# Altium schematic sheet MNA6A.SchDoc
size A4; SheetNumber: 1; SheetTotal: 4
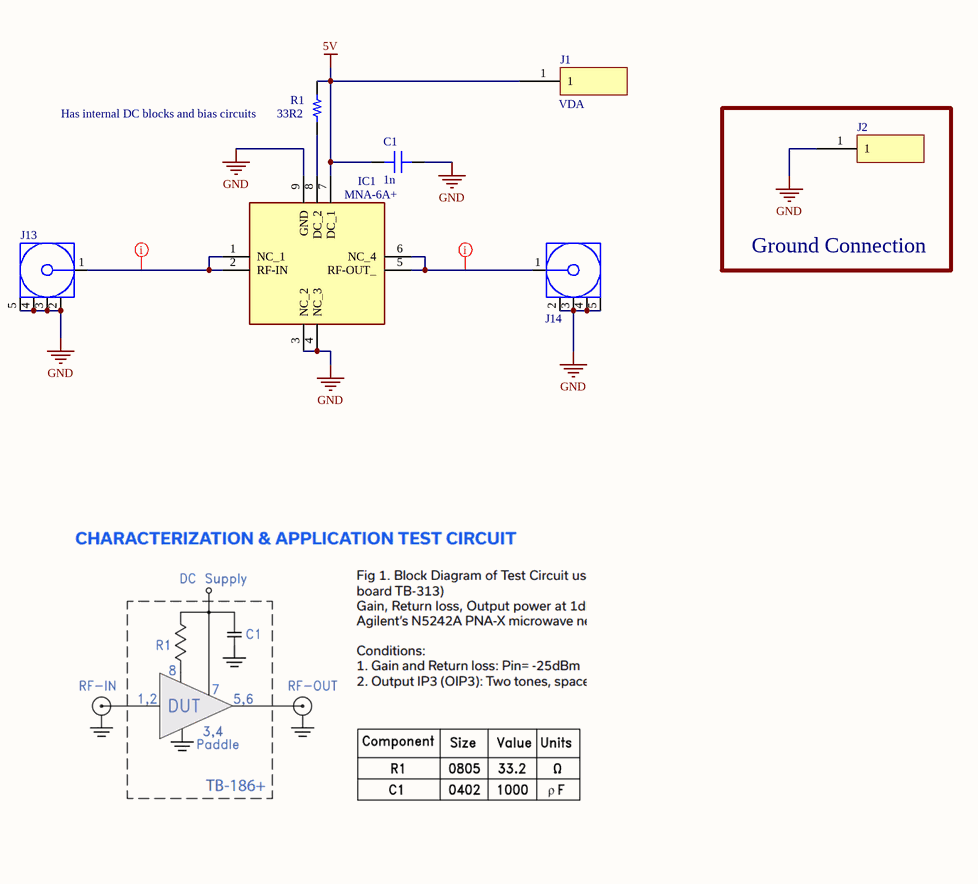
[diagram p0: MNA6A.SchDoc]

## Parts
C1  1n  [CAP 0603_1608 RF]
IC1  MNA-6A+  [MNA6A]
J1  Nail_Head  [Nail_Head]  (value not drawn)
J2  Nail_Head  [Nail_Head]  (value not drawn)
J13  60312202114513  [60312202114513]  (value not drawn)
J14  60312202114513  [60312202114513]  (value not drawn)
R1  33R2  [RES 0805_2012]

## Blocks framed on the sheet
Ground Connection: J2

## Nets
5V: C1.1 IC1.7(DC_1) J1.1 R1.2
GND: C1.2 IC1.3(NC_2) IC1.4(NC_3) IC1.9(GND) J2.1 J13.2(GND) J13.3(GND) J13.4(GND) J13.5(GND) J14.2(GND) J14.3(GND) J14.4(GND) J14.5(GND)
NetIC1_1: IC1.1(NC_1) IC1.2(RF-IN) J13.1(Signal)
NetIC1_5: IC1.5(RF-OUT_) IC1.6(NC_4) J14.1(Signal)
NetIC1_8: IC1.8(DC_2) R1.1

## Layout directives
net class CPWG: NetIC1_1, NetIC1_5

## Notes on the sheet
- (near R1) Has internal DC blocks and bias circuits
- (near J1) VDA

## Library data of the parts
C1 = UMK107SD102JA-T: CAP CER 1000PF 50V 0603; manufacturer: Taiyo Yuden; Tolerance: ±5%; Part Number: UMK107SD102JA-T; Applications: RF, Microwave, High Frequency; Capacitance: 1000pF; componentlink1description: Datasheet; componentlink1url: http://www.yuden.co.jp/productdata/catalog/mlcc07_e.pdf; componentlink2description: DigiKey Link; componentlink2url: http://digikey.com/product-detail/en/taiyo-yuden/UMK107SD102JA-T/587-1069-1-ND/930846; Device Package: 0603 (1608 Metric); Features: Low Distortion; lastupdated: 02/09/2020 01:17:16; Lifecycle Status: Active; Minimum Order: 1; Mounting Type: Surface Mount, MLCC; Operating Temperature: -55°C ~ 125°C; Package / Case: 0603 (1608 Metric); packaging: TapeAndReel; partid: 885; Part Status: Active; price: 0.07; series: CFCAP™; Size / Dimension: 0.063" L x 0.031" W (1.60mm x 0.80mm); Supplier 1: DigiKey; Supplier Part Number 1: 587-1069-1-ND; Thickness (Max): 0.035" (0.90mm); value: 1000pF; Voltage - Rated: 50V
IC1 = MNA-6A+: Integrated Circuit; Manufacturer_Name: Mini-Circuits; Height: 0.9916mm; Manufacturer_Part_Number: MNA-6A+; Mouser Part Number: 139-MNA-6A; Mouser Price/Stock: https://www.mouser.co.uk/ProductDetail/Mini-Circuits/MNA-6A%2b?qs=xZ%2FP%252Ba9zWqa51VJkRRE67Q%3D%3D; Supplier 1: Digi-Key; Supplier Part Number 1: 3157-MNA-6A+CT-ND
J1 J2 = Nail_Head: 1460-2-00-80-00-00-03-0 Mill-Max; Supplier 1: Farnell; Supplier Part Number 1: 3889056
J13 J14 = 60312202114513: WR-SMA Connector, PCB End Launch Jack, 6.35SQ Flange Flat Tab 1.6mm, DC~18GHz, 50Ohm; Manufacturer: Wurth Elektronik; Center Contact Diameter: 0.51 WIDE x 0.25 THK; Connector Type: SMA; Interface Type: MIL-STD-348; Manufacturer Part Number: 60312202114513; Category: Coaxial Connectors; Match Code: WR-SMA; ComponentLink1Description: Website Link; ComponentLink1URL: https://www.we-online.com/redexpert/article/60312202114513?ad; ComponentLink2Description: Datasheet Link; ComponentLink2URL: https://www.we-online.com/redexpert/spec/60312202114513?ad; Mount: End Launch; Operating Temperature Max: 165°C; Operating Temperature Min: -65°C; Packaging: Tray; Frequency Range: DC~18GHz; Gender: Jack; Impedance: 50Ohm; Orientation: Straight
R1 = RCS080533R2FKEA: RES SMD 33.2 OHM 1% 1/2W 0805; Manufacturer: Vishay Dale; Power (Watts): 0.5W, 1/2W; Resistance: 33.2 Ohms; Temperature Coefficient: ±100ppm/°C; Part Number: RCS080533R2FKEA; Value: 33R2; ComponentLink1Description: Datasheet; ComponentLink1URL: http://www.vishay.com/docs/20065/rcse3.pdf; ComponentLink2Description: DigiKey Link; ComponentLink2URL: https://www.digikey.com/en/products/detail/vishay-dale/RCS080533R2FKEA/5866976; Composition: Thick Film; Device Package: 0805 (2012 Metric); Features: Automotive AEC-Q200, Pulse Withstanding; Height - Seated (Max): 0.020" (0.50mm); LastUpdated: 21/05/2023 19:41:30; Lifecycle Status: Active; Minimum Order: 1; Number of Terminations: 2; Operating Temperature: -55°C ~ 155°C; Package / Case: 0805 (2012 Metric); Packaging: TapeAndReel; PartId: 34966; Part Status: Active; Price: 0.02; Ratings: AEC-Q200; Series: RCS e3; Size / Dimension: 0.079" L x 0.049" W (2.00mm x 1.25mm); Supplier 1: DigiKey; Supplier Part Number 1: 541-2830-1-ND; Supplier Device Package: 0805; Tolerance: ±1%